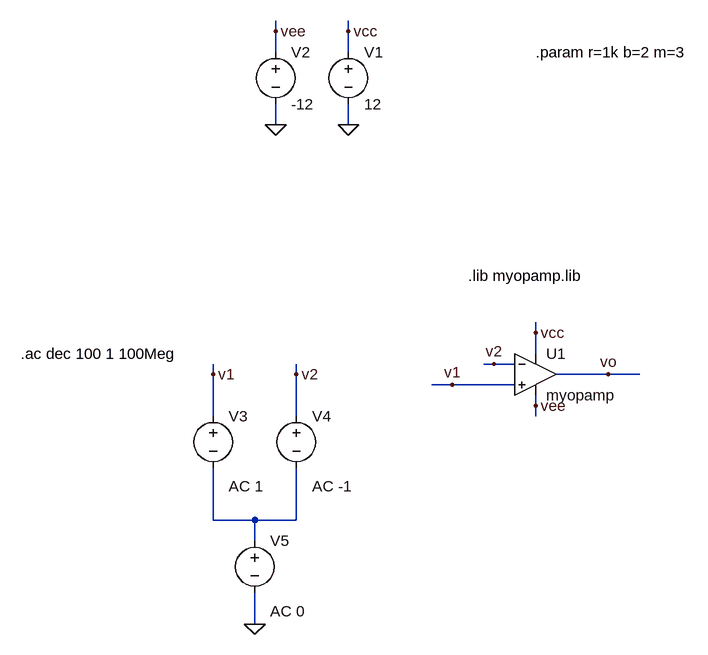
[diagram p0: schematic myOpAmp.asc]
myOpAmp.asc, the LTspice schematic file:
Version 4
SHEET 1 1172 756
WIRE -400 -176 -400 -192
WIRE -288 -176 -288 -192
WIRE -400 -144 -400 -176
WIRE -288 -144 -288 -176
WIRE -400 -32 -400 -64
WIRE -288 -32 -288 -64
WIRE 0 288 0 272
WIRE 0 320 0 288
WIRE -64 336 -80 336
WIRE -32 336 -64 336
WIRE -496 352 -496 336
WIRE -368 352 -368 336
WIRE 112 352 32 352
WIRE 160 352 112 352
WIRE -128 368 -160 368
WIRE -32 368 -128 368
WIRE 0 400 0 384
WIRE -496 416 -496 352
WIRE -368 416 -368 352
WIRE 0 416 0 400
WIRE -496 576 -496 496
WIRE -432 576 -496 576
WIRE -368 576 -368 496
WIRE -368 576 -432 576
WIRE -432 608 -432 576
WIRE -432 736 -432 688
FLAG -288 -32 0
FLAG -400 -32 0
FLAG -288 -176 vcc
FLAG -400 -176 vee
FLAG -496 352 v1
FLAG -368 352 v2
FLAG 0 288 vcc
FLAG 0 400 vee
FLAG -128 368 v1
FLAG -64 336 v2
FLAG 112 352 vo
FLAG -432 736 0
SYMBOL voltage -288 -160 R0
WINDOW 123 0 0 Left 0
WINDOW 39 0 0 Left 0
SYMATTR InstName V1
SYMATTR Value 12
SYMBOL voltage -400 -160 R0
WINDOW 123 0 0 Left 0
WINDOW 39 0 0 Left 0
SYMATTR InstName V2
SYMATTR Value -12
SYMBOL voltage -496 400 R0
WINDOW 123 24 124 Left 2
WINDOW 39 0 0 Left 0
SYMATTR Value2 AC 1
SYMATTR InstName V3
SYMATTR Value ""
SYMBOL voltage -368 400 R0
WINDOW 123 24 124 Left 2
WINDOW 39 0 0 Left 0
SYMATTR Value2 AC -1
SYMATTR InstName V4
SYMATTR Value ""
SYMBOL voltage -432 592 R0
WINDOW 123 24 124 Left 2
WINDOW 39 0 0 Left 0
SYMATTR Value2 AC 0
SYMATTR InstName V5
SYMATTR Value ""
SYMBOL OpAmps\\opamp2 0 288 R0
SYMATTR InstName U1
SYMATTR Value myopamp
SYMATTR SpiceModel myopamp
TEXT 0 -144 Left 2 !.param r=1k b=2 m=3
TEXT -792 320 Left 2 !.ac dec 100 1 100Meg
TEXT -104 200 Left 2 !.lib myopamp.lib

The netlist it stands for:
* myOpAmp.asc
V1 vcc 0 12
V2 vee 0 -12
V3 v1 N001 AC 1
V4 v2 N001 AC -1
V5 N001 0 AC 0
XU1 v1 v2 vcc vee vo myopamp myopamp  ; pins In+ In- V+ V- OUT
.param r=1k b=2 m=3
.ac dec 100 1 100Meg
.lib myopamp.lib
.backanno
.end